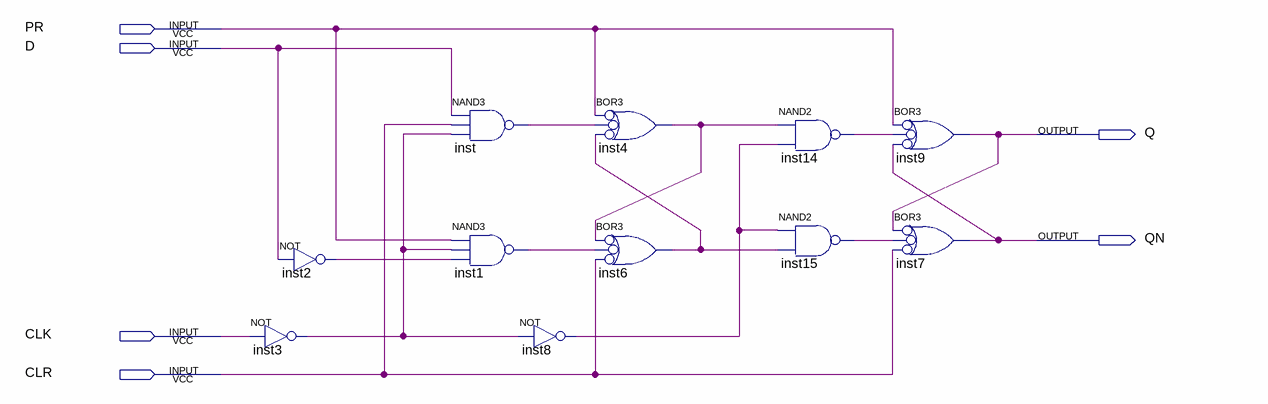
[diagram p0: schematic sheet]
// Quartus schematic ffd.bdf as structural Verilog: 11 symbols, 6 pins
module ffd (
  input  PR,
  input  D,
  input  CLK,
  input  CLR,
  output Q,
  output QN
);

  wire inst1_out, inst2_out, inst3_out, inst4_out, inst6_out, inst8_out, inst14_out, inst15_out, inst_out;

  not inst2 (inst2_out, D);
  not inst3 (inst3_out, CLK);
  nand inst (inst_out, D, CLR, inst3_out);
  nand inst1 (inst1_out, PR, inst3_out, inst2_out);
  not inst8 (inst8_out, inst3_out);
  or inst4 (inst4_out, ~PR, ~inst_out, ~inst6_out);  // BOR3
  or inst6 (inst6_out, ~inst4_out, ~inst1_out, ~CLR);  // BOR3
  nand inst14 (inst14_out, inst4_out, inst8_out);
  nand inst15 (inst15_out, inst8_out, inst6_out);
  or inst9 (Q, ~PR, ~inst14_out, ~QN);  // BOR3
  or inst7 (QN, ~Q, ~inst15_out, ~CLR);  // BOR3
endmodule
